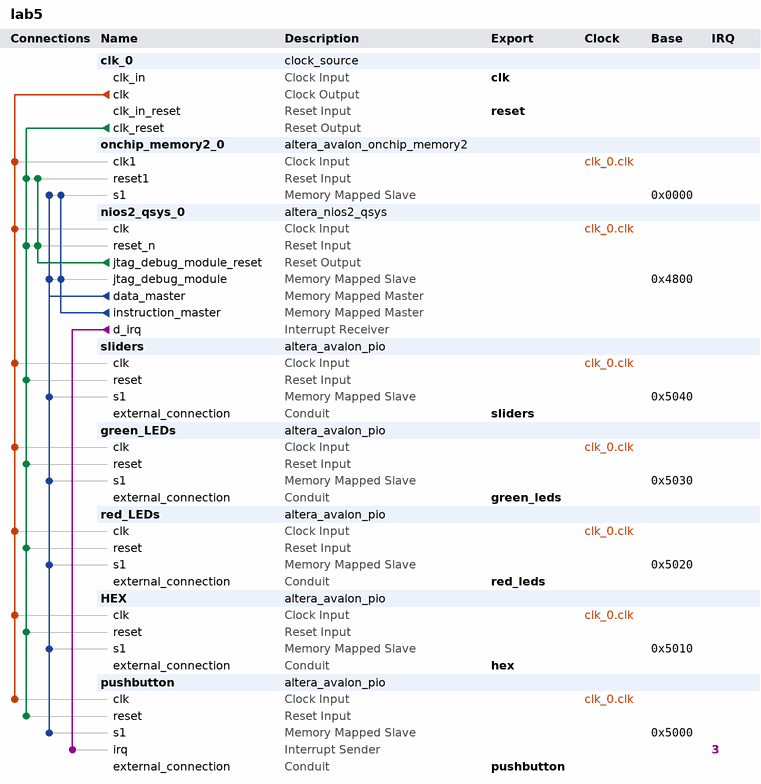
[diagram p0: system contents]
# Platform Designer (Qsys) system lab5, Cyclone II EP2C35F672C6
# Parameters at their usual value, and those the tool derives, are not listed.
package require -exact qsys 13.0.1.99.2
create_system lab5
set_project_property DEVICE_FAMILY {Cyclone II}
set_project_property DEVICE EP2C35F672C6

add_instance clk_0 clock_source 13.0
set_instance_parameter_value clk_0 clockFrequency 50000000

add_instance onchip_memory2_0 altera_avalon_onchip_memory2 13.0.1.99.2
set_instance_parameter_value onchip_memory2_0 dataWidth 32
set_instance_parameter_value onchip_memory2_0 dualPort false
set_instance_parameter_value onchip_memory2_0 initMemContent true
set_instance_parameter_value onchip_memory2_0 initializationFileName onchip_mem.hex
set_instance_parameter_value onchip_memory2_0 memorySize 16384

add_instance nios2_qsys_0 altera_nios2_qsys 13.0
set_instance_parameter_value nios2_qsys_0 resetSlave onchip_memory2_0.s1
set_instance_parameter_value nios2_qsys_0 mmu_TLBMissExcSlave None
set_instance_parameter_value nios2_qsys_0 exceptionSlave onchip_memory2_0.s1
set_instance_parameter_value nios2_qsys_0 breakSlave nios2_qsys_0.jtag_debug_module
set_instance_parameter_value nios2_qsys_0 muldiv_multiplierType NoneSmall
set_instance_parameter_value nios2_qsys_0 impl Small
set_instance_parameter_value nios2_qsys_0 icache_size 4096
set_instance_parameter_value nios2_qsys_0 debug_level Level3

add_instance sliders altera_avalon_pio 13.0.1.99.2
set_instance_parameter_value sliders direction Input
set_instance_parameter_value sliders width 8

add_instance green_LEDs altera_avalon_pio 13.0.1.99.2
set_instance_parameter_value green_LEDs direction Output
set_instance_parameter_value green_LEDs width 8

add_instance red_LEDs altera_avalon_pio 13.0.1.99.2
set_instance_parameter_value red_LEDs direction Output
set_instance_parameter_value red_LEDs width 16

add_instance HEX altera_avalon_pio 13.0.1.99.2
set_instance_parameter_value HEX direction Output
set_instance_parameter_value HEX width 32

add_instance pushbutton altera_avalon_pio 13.0.1.99.2
set_instance_parameter_value pushbutton captureEdge true
set_instance_parameter_value pushbutton direction Input
set_instance_parameter_value pushbutton edgeType FALLING
set_instance_parameter_value pushbutton generateIRQ true
set_instance_parameter_value pushbutton width 1

# connections
add_connection clk_0.clk green_LEDs.clk clock
add_connection clk_0.clk HEX.clk clock
add_connection clk_0.clk nios2_qsys_0.clk clock
add_connection clk_0.clk onchip_memory2_0.clk1 clock
add_connection clk_0.clk pushbutton.clk clock
add_connection clk_0.clk red_LEDs.clk clock
add_connection clk_0.clk sliders.clk clock
add_connection clk_0.clk_reset green_LEDs.reset reset
add_connection clk_0.clk_reset HEX.reset reset
add_connection clk_0.clk_reset nios2_qsys_0.reset_n reset
add_connection clk_0.clk_reset onchip_memory2_0.reset1 reset
add_connection clk_0.clk_reset pushbutton.reset reset
add_connection clk_0.clk_reset red_LEDs.reset reset
add_connection clk_0.clk_reset sliders.reset reset
add_connection nios2_qsys_0.jtag_debug_module_reset nios2_qsys_0.reset_n reset
add_connection nios2_qsys_0.jtag_debug_module_reset onchip_memory2_0.reset1 reset
add_connection nios2_qsys_0.data_master green_LEDs.s1 avalon
set_connection_parameter_value nios2_qsys_0.data_master/green_LEDs.s1 baseAddress 0x5030
add_connection nios2_qsys_0.data_master HEX.s1 avalon
set_connection_parameter_value nios2_qsys_0.data_master/HEX.s1 baseAddress 0x5010
add_connection nios2_qsys_0.data_master nios2_qsys_0.jtag_debug_module avalon
set_connection_parameter_value nios2_qsys_0.data_master/nios2_qsys_0.jtag_debug_module baseAddress 0x4800
add_connection nios2_qsys_0.data_master onchip_memory2_0.s1 avalon
set_connection_parameter_value nios2_qsys_0.data_master/onchip_memory2_0.s1 baseAddress 0x0000
add_connection nios2_qsys_0.data_master pushbutton.s1 avalon
set_connection_parameter_value nios2_qsys_0.data_master/pushbutton.s1 baseAddress 0x5000
add_connection nios2_qsys_0.data_master red_LEDs.s1 avalon
set_connection_parameter_value nios2_qsys_0.data_master/red_LEDs.s1 baseAddress 0x5020
add_connection nios2_qsys_0.data_master sliders.s1 avalon
set_connection_parameter_value nios2_qsys_0.data_master/sliders.s1 baseAddress 0x5040
add_connection nios2_qsys_0.instruction_master nios2_qsys_0.jtag_debug_module avalon
set_connection_parameter_value nios2_qsys_0.instruction_master/nios2_qsys_0.jtag_debug_module baseAddress 0x4800
add_connection nios2_qsys_0.instruction_master onchip_memory2_0.s1 avalon
set_connection_parameter_value nios2_qsys_0.instruction_master/onchip_memory2_0.s1 baseAddress 0x0000
add_connection nios2_qsys_0.d_irq pushbutton.irq interrupt
set_connection_parameter_value nios2_qsys_0.d_irq/pushbutton.irq irqNumber 3

# exported interfaces
add_interface clk clock sink
set_interface_property clk EXPORT_OF clk_0.clk_in
add_interface reset reset sink
set_interface_property reset EXPORT_OF clk_0.clk_in_reset
add_interface sliders conduit end
set_interface_property sliders EXPORT_OF sliders.external_connection
add_interface green_leds conduit end
set_interface_property green_leds EXPORT_OF green_LEDs.external_connection
add_interface red_leds conduit end
set_interface_property red_leds EXPORT_OF red_LEDs.external_connection
add_interface hex conduit end
set_interface_property hex EXPORT_OF HEX.external_connection
add_interface pushbutton conduit end
set_interface_property pushbutton EXPORT_OF pushbutton.external_connection

set_interconnect_requirement {$system} qsys_mm.clockCrossingAdapter HANDSHAKE
set_interconnect_requirement {$system} qsys_mm.maxAdditionalLatency 1

save_system lab5.qsys
